# EasyEDA schematic SCH_CadMacroBoard_2024-11-26.json
TITLE: Sheet_1; REV: 1.0; Date: 2024-11-23; Sheet: 1/1; Drawn By: batgab; Company: Your Company
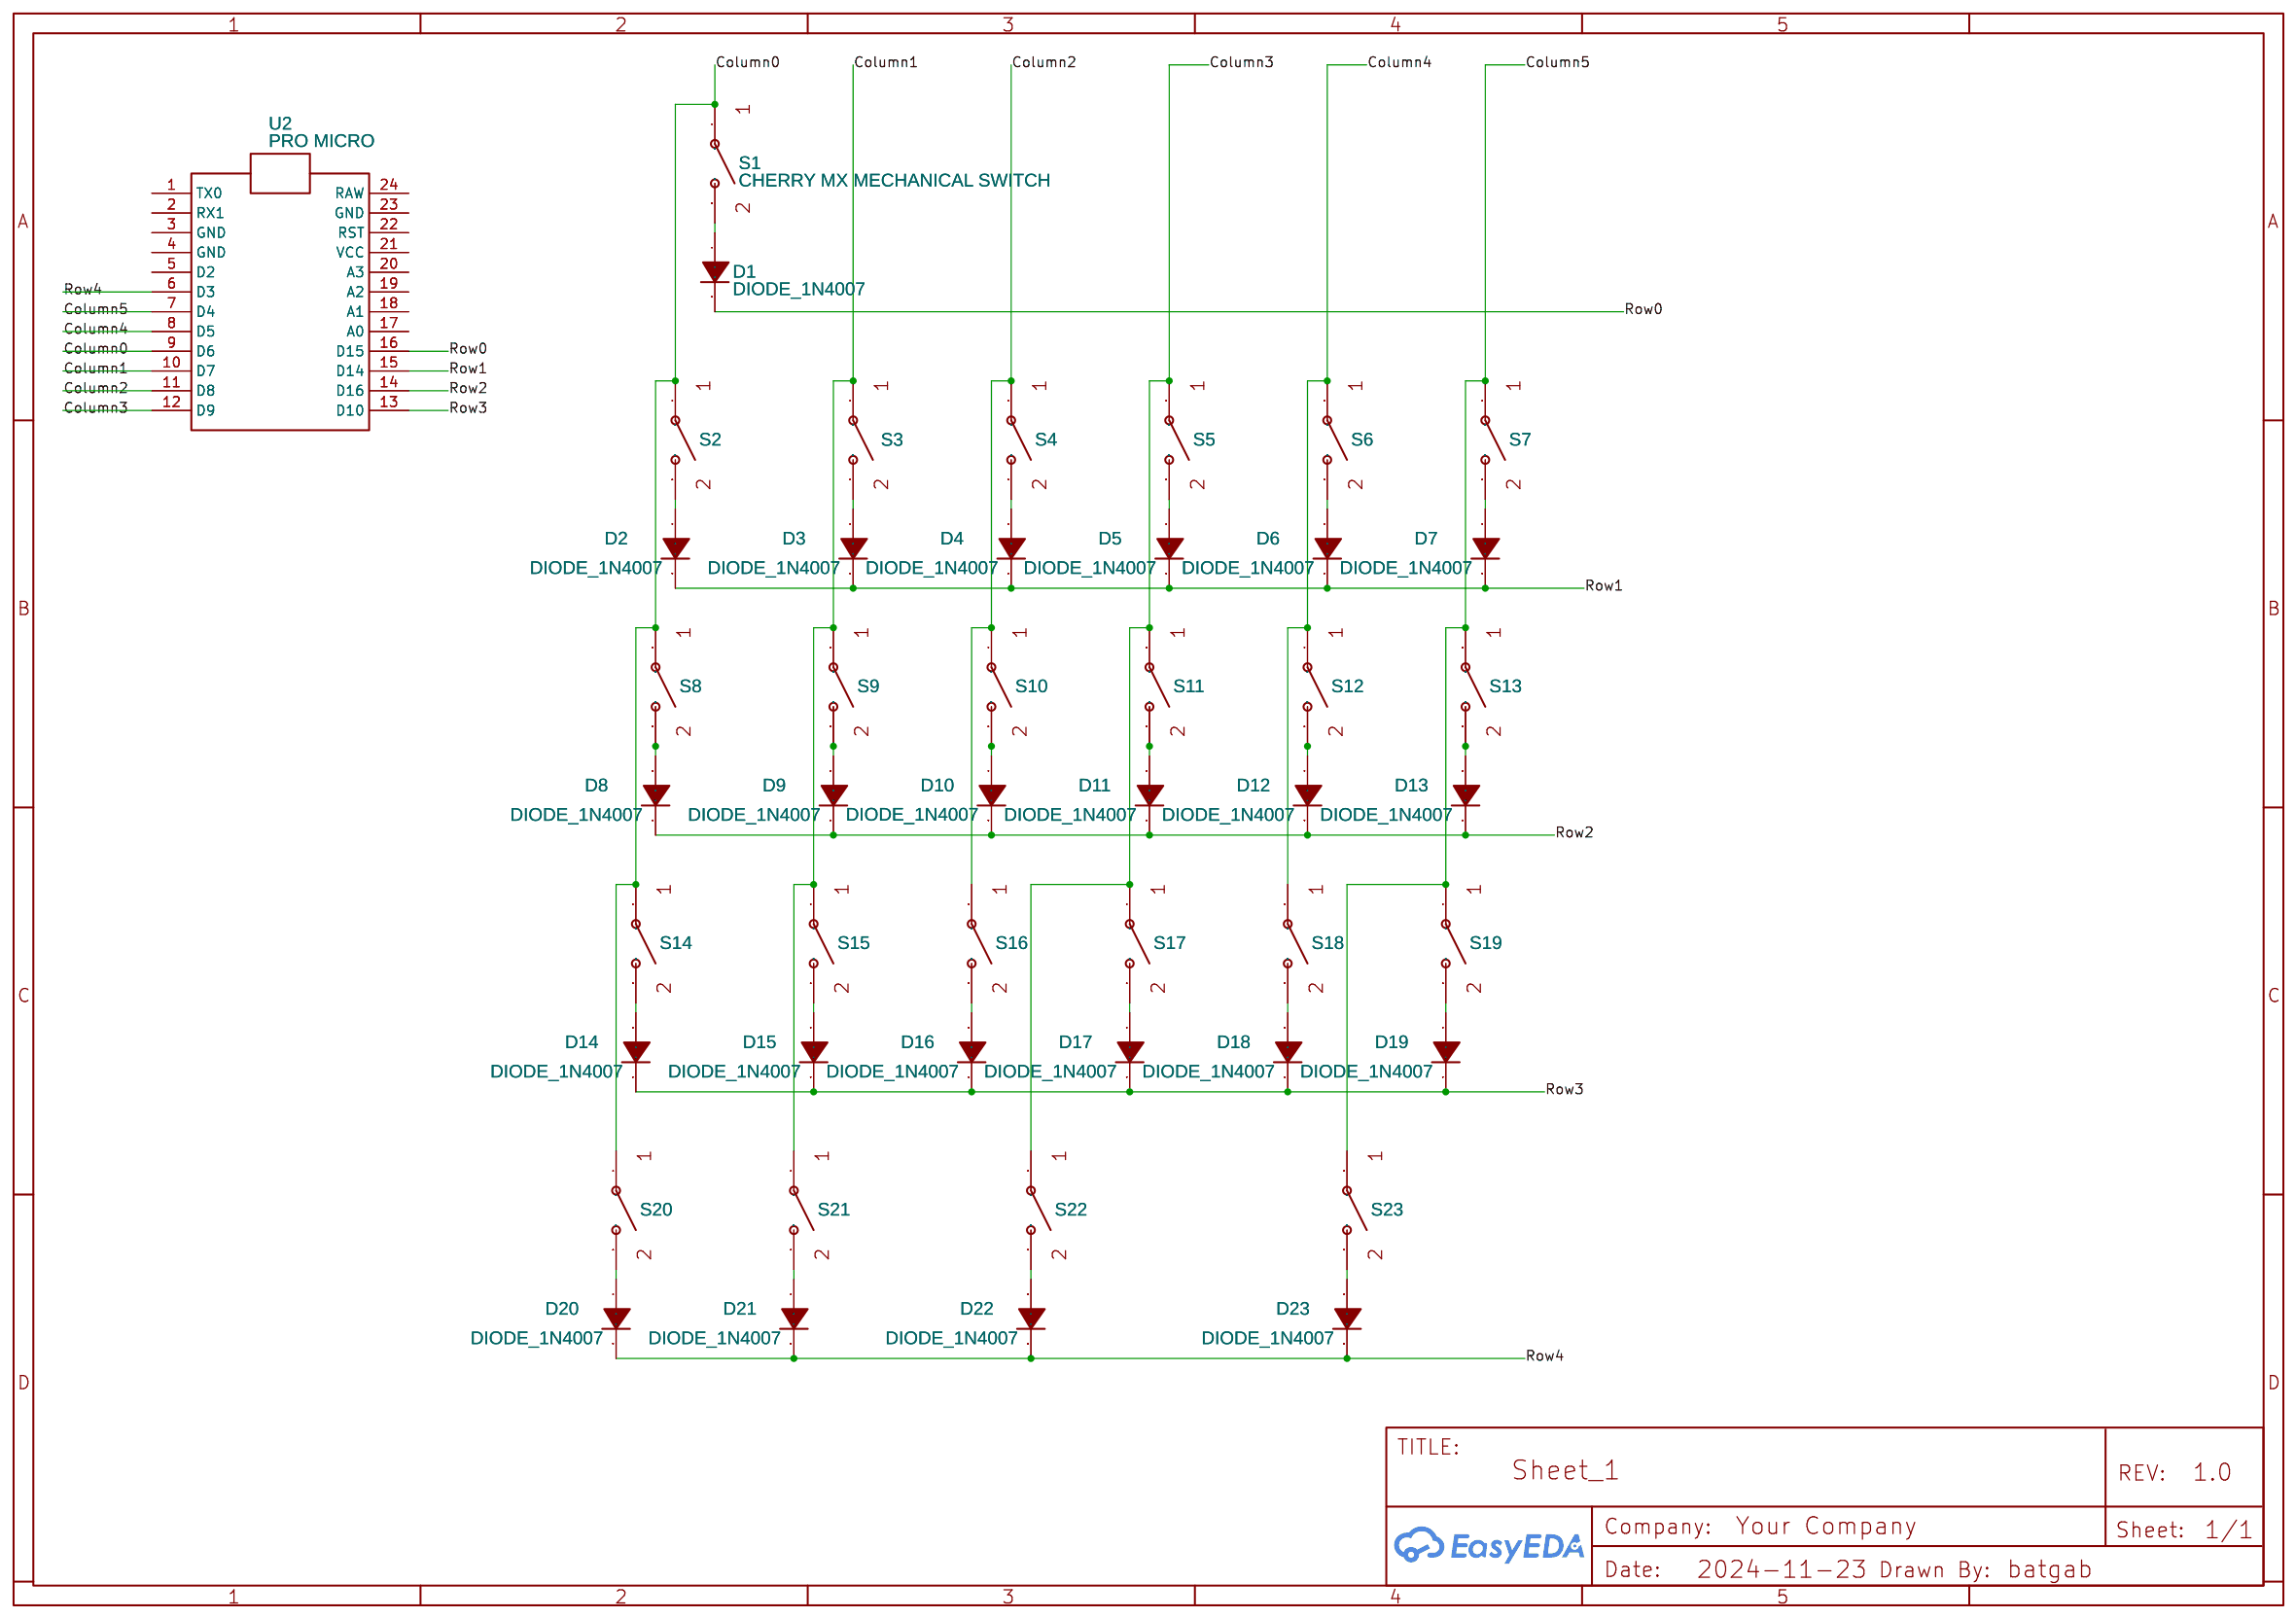
[diagram p0: schematic sheet]

## Parts
D1  DIODE_1N4007  [DIODE_1N4007]
D2  DIODE_1N4007  [DIODE_1N4007]
D3  DIODE_1N4007  [DIODE_1N4007]
D4  DIODE_1N4007  [DIODE_1N4007]
D5  DIODE_1N4007  [DIODE_1N4007]
D6  DIODE_1N4007  [DIODE_1N4007]
D7  DIODE_1N4007  [DIODE_1N4007]
D8  DIODE_1N4007  [DIODE_1N4007]
D9  DIODE_1N4007  [DIODE_1N4007]
D10  DIODE_1N4007  [DIODE_1N4007]
D11  DIODE_1N4007  [DIODE_1N4007]
D12  DIODE_1N4007  [DIODE_1N4007]
D13  DIODE_1N4007  [DIODE_1N4007]
D14  DIODE_1N4007  [DIODE_1N4007]
D15  DIODE_1N4007  [DIODE_1N4007]
D16  DIODE_1N4007  [DIODE_1N4007]
D17  DIODE_1N4007  [DIODE_1N4007]
D18  DIODE_1N4007  [DIODE_1N4007]
D19  DIODE_1N4007  [DIODE_1N4007]
D20  DIODE_1N4007  [DIODE_1N4007]
D21  DIODE_1N4007  [DIODE_1N4007]
D22  DIODE_1N4007  [DIODE_1N4007]
D23  DIODE_1N4007  [DIODE_1N4007]
S1  CHERRY MX MECHANICAL SWITCH  [CHERRY MX KEYSWITCH]
S2  CHERRY MX MECHANICAL SWITCH  [CHERRY MX KEYSWITCH]
S3  CHERRY MX MECHANICAL SWITCH  [CHERRY MX KEYSWITCH]
S4  CHERRY MX MECHANICAL SWITCH  [CHERRY MX KEYSWITCH]
S5  CHERRY MX MECHANICAL SWITCH  [CHERRY MX KEYSWITCH]
S6  CHERRY MX MECHANICAL SWITCH  [CHERRY MX KEYSWITCH]
S7  CHERRY MX MECHANICAL SWITCH  [CHERRY MX KEYSWITCH]
S8  CHERRY MX MECHANICAL SWITCH  [CHERRY MX KEYSWITCH]
S9  CHERRY MX MECHANICAL SWITCH  [CHERRY MX KEYSWITCH]
S10  CHERRY MX MECHANICAL SWITCH  [CHERRY MX KEYSWITCH]
S11  CHERRY MX MECHANICAL SWITCH  [CHERRY MX KEYSWITCH]
S12  CHERRY MX MECHANICAL SWITCH  [CHERRY MX KEYSWITCH]
S13  CHERRY MX MECHANICAL SWITCH  [CHERRY MX KEYSWITCH]
S14  CHERRY MX MECHANICAL SWITCH  [CHERRY MX KEYSWITCH]
S15  CHERRY MX MECHANICAL SWITCH  [CHERRY MX KEYSWITCH]
S16  CHERRY MX MECHANICAL SWITCH  [CHERRY MX KEYSWITCH]
S17  CHERRY MX MECHANICAL SWITCH  [CHERRY MX KEYSWITCH]
S18  CHERRY MX MECHANICAL SWITCH  [CHERRY MX KEYSWITCH]
S19  CHERRY MX MECHANICAL SWITCH  [CHERRY MX KEYSWITCH]
S20  CHERRY MX MECHANICAL SWITCH  [CHERRY MX KEYSWITCH]
S21  CHERRY MX MECHANICAL SWITCH  [CHERRY MX KEYSWITCH]
S22  CHERRY MX MECHANICAL SWITCH  [CHERRY MX KEYSWITCH]
S23  CHERRY MX MECHANICAL SWITCH  [CHERRY MX KEYSWITCH]
U2  PRO MICRO  [ARDUINO-PRO-MICRO]

## Library data of the parts
D1-D23 = 1N4007: Manufacturer: ST(先科); Supplier Part: C106903; JLCPCB Part Class: Extended Part; Contributor: Darvin995
S1-S23 = CHERRY MX MECHANICAL SWITCH: Contributor: clay53
U2 = PRO MICRO: Contributor: Matheus rampazzo e silva

## Nets
Column0: S1.1 S2.1 S8.1 S14.1 S20.1 U2.9(D6)
Column1: S3.1 S9.1 S15.1 S21.1 U2.10(D7)
Column2: S4.1 S10.1 S16.1 U2.11(D8)
Column3: S5.1 S11.1 S17.1 S22.1 U2.12(D9)
Column4: S6.1 S12.1 S18.1 U2.8(D5)
Column5: S7.1 S13.1 S19.1 S23.1 U2.7(D4)
Row0: D1.2(K) U2.16(D15)
Row1: D2.2(K) D3.2(K) D4.2(K) D5.2(K) D6.2(K) D7.2(K) U2.15(D14)
Row2: D8.2(K) D9.2(K) D10.2(K) D11.2(K) D12.2(K) D13.2(K) U2.14(D16)
Row3: D14.2(K) D15.2(K) D16.2(K) D17.2(K) D18.2(K) D19.2(K) U2.13(D10)
Row4: D20.2(K) D21.2(K) D22.2(K) D23.2(K) U2.6(D3)
Net-(D1-1): D1.1(A) S1.2
Net-(D2-1): D2.1(A) S2.2
Net-(D3-1): D3.1(A) S3.2
Net-(D4-1): D4.1(A) S4.2
Net-(D5-1): D5.1(A) S5.2
Net-(D6-1): D6.1(A) S6.2
Net-(D7-1): D7.1(A) S7.2
Net-(D8-1): D8.1(A) S8.2
Net-(D9-1): D9.1(A) S9.2
Net-(D10-1): D10.1(A) S10.2
Net-(D11-1): D11.1(A) S11.2
Net-(D12-1): D12.1(A) S12.2
Net-(D13-1): D13.1(A) S13.2
Net-(D14-1): D14.1(A) S14.2
Net-(D15-1): D15.1(A) S15.2
Net-(D16-1): D16.1(A) S16.2
Net-(D17-1): D17.1(A) S17.2
Net-(D18-1): D18.1(A) S18.2
Net-(D19-1): D19.1(A) S19.2
Net-(D20-1): D20.1(A) S20.2
Net-(D21-1): D21.1(A) S21.2
Net-(D22-1): D22.1(A) S22.2
Net-(D23-1): D23.1(A) S23.2

Not connected (* = marked no-connect by the designer): U2 1(TX0) 2(RX1) 3(GND) 4(GND) 5(D2) 17(A0) 18(A1) 19(A2) 20(A3) 21(VCC) 22(RST) 23(GND) 24(RAW)
